# Altium schematic sheet TPS40200BuckDesign.SchDoc
size 431 x 279 mm; Date: Not shown in title block; ApprovedBy: Not shown in title block; CheckedBy: Not shown in title block; Author: Not shown in title block; CompanyName: Not shown in title block; Engineer: Not shown in title block; Organization: Not shown in title block; Address1: Not shown in title block; Address2: Not shown in title block; Address3: Not shown in title block; Address4: Not shown in title block; DocumentNumber: 2; Revision: Use project parameter SCH_Rev; SheetNumber: 1; SheetTotal: 1; PageSetup: Record=PageOptions|CenterHorizontal=True|CenterVertical=True|PrintScale=1.00|XCorrection=1.00|YCorrection=1.00|PrintKind=0|BorderSize=5000000|LeftOffset=0|BottomOffset=0|Orientation=2|PaperLength=1000|PaperWidth=1000|Scale=100|PaperSource=15|PrintQuality=600|MediaType=1|DitherType=10|PaperKind=Letter|PrintScaleMode=1; CurrentTime: Not shown in title block; CurrentDate: Not shown in title block; Time: Not shown in title block; DocumentFullPathAndName: Not shown in title block; DocumentName: Not shown in title block; ModifiedDate: 1/25/2022; ImagePath: Not shown in title block
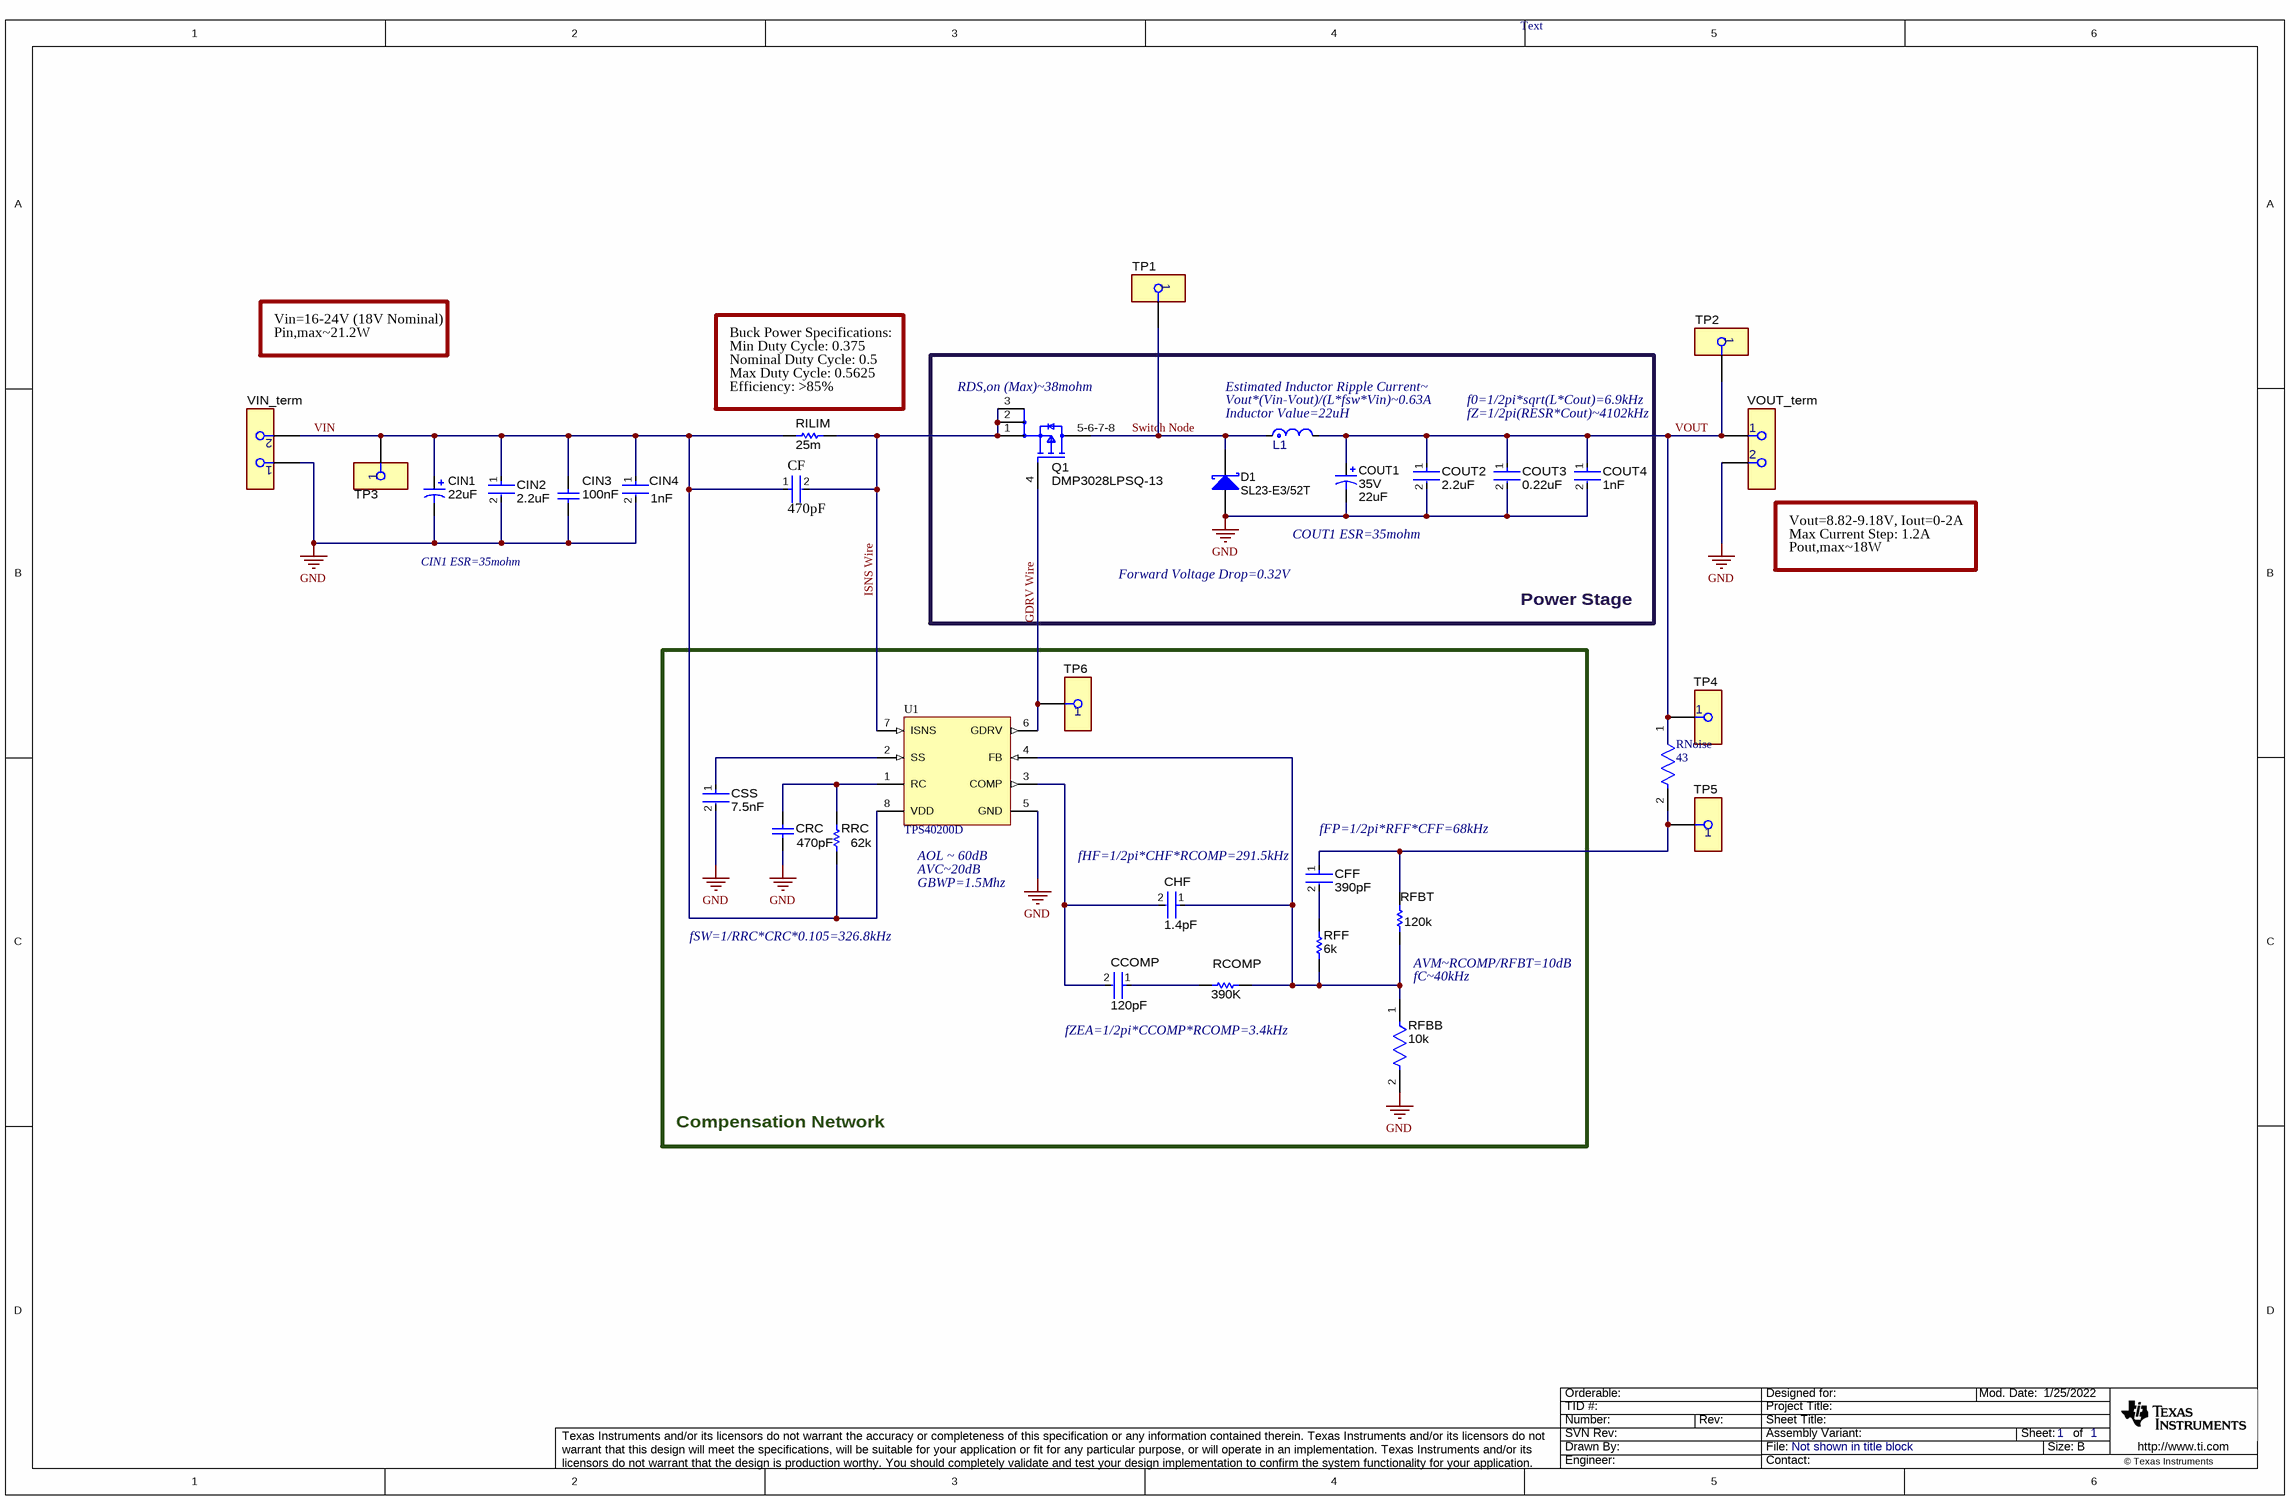
[diagram p0: TPS40200BuckDesign.SchDoc]

## Parts
CCOMP  120pF  [FP-CL21-IPC_C]
CF  470pF  [FP-0805-L_2_01_0_2-W_1_25-IPC_B]
CFF  390pF  [FP-CC0603-DA-MFG]
CHF  1.4pF  [FP-CBR06C-MFG]
CIN1  ValueDisplayed: 22uF  [CAPSMT_62_F61]  (hidden comment: 35SVPF22M)
CIN2  2.2uF  [FP-GRM188-0_1-e0_2_0_5-IPC_C]
CIN3  100nF  [CAPC1608X90X40LL10T20]
CIN4  1nF  [FP-C0603C-CF-MFG]
COUT1  VDC_V: 35V  ValueDisplayed: 22uF  [CAPSMT_62_F61]  (hidden comment: 35SVPF22M)
COUT2  2.2uF  [FP-CL10-IPC_C]
COUT3  0.22uF  [FP-GRM188-0_1-e0_2_0_5-IPC_C]
COUT4  1nF  [FP-CL10-IPC_C]
CRC  ValueDisplayed: 470pF  [0603]  (hidden comment: GCM1885C1H471JA16D)
CSS  7.5nF  [FP-GRM188-0_1-e0_2_0_5-IPC_C]
D1  SL23-E3/52T  [SMB]
L1  XAL8080-223MED  [FP-XAL8080-223MED_SMT_IND_8MM1_8MM6-MFG]  (value not drawn)
Q1  DMP3028LPSQ-13  [FP-DMP3028LPSQ-13_PowerDI5060-8-MFG]
RCOMP  390K  [RESC0805(2012)_M]
RFBB  10k  [FP-MCT0603-IPC_B]
RFBT  120k  [RESC1609X50X30ML10T20]
RFF  6k  [RESC1608X55X25ML10T15]
RILIM  25m  [RESC2013X50X40ML20T20]
RNoise  43  [FP-CR0603-IPC_C]
RRC  62k  [RESC1609X50X30NL10T20]
TP1  (no value)  [FP-RCWCTE_SMT_TP-MFG]
TP2  (no value)  [FP-RCWCTE_SMT_TP-MFG]
TP3  (no value)  [FP-RCWCTE_SMT_TP-MFG]
TP4  (no value)  [FP-RCWCTE_SMT_TP-MFG]
TP5  (no value)  [FP-RCWCTE_SMT_TP-MFG]
TP6  (no value)  [FP-RCWCTE_SMT_TP-MFG]
U1  TPS40200D  [D0008A_N]
VIN_term  (no value)  [FP-691137710002_HDR2-MFG]
VOUT_term  (no value)  [FP-691137710002_HDR2-MFG]

## Blocks framed on the sheet
Power Stage: COUT1-COUT4 D1 L1 Q1
Compensation Network: CCOMP CFF CHF CRC CSS RCOMP RFBB RFBT RFF RRC TP6 U1

## Nets
GND: CIN1.2(-) CIN2.2 CIN3.1 CIN4.2 COUT1.2(-) COUT2.2 COUT3.2 COUT4.2 CRC.2 CSS.2 D1.2(A) RFBB.2 U1.5(GND) VIN_term.1 VOUT_term.2
GDRV Wire: Q1.4(G) TP6.1 U1.6(GDRV)
ISNS Wire: CF.2 Q1.1(S) Q1.2(S) Q1.3(S) RILIM.2 U1.7(ISNS)
Switch Node: D1.1(K) L1.1 Q1.5-6-7-8(D) TP1.1
VIN: CF.1 CIN1.1(+) CIN2.1 CIN3.2 CIN4.1 RILIM.1 RRC.1 TP3.1 U1.8(VDD) VIN_term.2
VOUT: COUT1.1(+) COUT2.1 COUT3.1 COUT4.1 L1.2 RNoise.1 TP2.1 TP4.1 VOUT_term.1
NetCCOMP_1: CCOMP.1 RCOMP.1
NetCCOMP_2: CCOMP.2 CHF.2 U1.3(COMP)
NetCFF_1: CFF.1 RFBT.2 RNoise.2 TP5.1
NetCFF_2: CFF.2 RFF.2
NetCHF_1: CHF.1 RCOMP.2 RFBB.1 RFBT.1 RFF.1 U1.4(FB)
NetCRC_1: CRC.1 RRC.2 U1.1(RC)
NetCSS_1: CSS.1 U1.2(SS)

## Notes on the sheet
- Text
- Vin=16-24V (18V Nominal)
- Pin,max~21.2W
- Nominal Duty Cycle: 0.5
- Min Duty Cycle: 0.375
- Max Duty Cycle: 0.5625
- Buck Power Specifications:
- (near RILIM) Efficiency: >85%
- (near Q1) RDS,on (Max)~38mohm
- (near L1) Estimated Inductor Ripple Current~
- (near L1) Vout*(Vin-Vout)/(L*fsw*Vin)~0.63A
- (near L1) Inductor Value=22uH
- f0=1/2pi*sqrt(L*Cout)=6.9kHz
- fZ=1/2pi(RESR*Cout)~4102kHz
- CIN1 ESR=35mohm
- Forward Voltage Drop=0.32V
- COUT1 ESR=35mohm
- Vout=8.82-9.18V, Iout=0-2A
- Max Current Step: 1.2A
- Pout,max~18W
- (near CFF) fFP=1/2pi*RFF*CFF=68kHz
- AVC~20dB
- (near U1) AOL ~ 60dB
- GBWP=1.5Mhz
- fHF=1/2pi*CHF*RCOMP=291.5kHz
- fSW=1/RRC*CRC*0.105=326.8kHz
- (near RFBT) AVM~RCOMP/RFBT=10dB
- fC~40kHz
- fZEA=1/2pi*CCOMP*RCOMP=3.4kHz
- Drawn By:
- SVN Rev:
- Number:
- TID #:
- Orderable:
- Rev:
- Sheet Title:
- File:
- Project Title:
- Designed for:
- Assembly Variant:
- Mod. Date:
- Sheet:
- Size:
- of
- B
- http://www.ti.com
- Texas Instruments and/or its licensors do not warrant the accuracy or completeness of this specification or any information contained therein. Texas Instruments and/or its licensors do not warrant that this design will meet the specifications, will be suitable for your application or fit for any particular purpose, or will operate in an implementation. Texas Instruments and/or its licensors do not warrant that the design is production worthy. You should completely validate and test your design implementation to confirm the system functionality for your application.
- Engineer:
- Contact:
- © Texas Instruments

## Library data of the parts
CCOMP = CMP-13271-002834-1: CL21 Series 0805 120pF 200V ±5% Tolerance C0G Multilayer Ceramic Chip Capacitor; Case Code (Imperial): 0805; Depth: 1.25mm; Voltage Rating (DC): 200V; Capacitance: 120pF; Radiation Hardening: No; Packaging: Tape and Reel; Case/Package: 0805; Tolerance: 5%; Height: 0.85mm; Min Operating Temperature: -55°C; Thickness: 0.037inch; Max Operating Temperature: 125°C; Mount: Surface Mount; Package Quantity: 1; Dielectric: C0G; Case Code (Metric): 2012; Length: 2mm; Lead Free: Lead Free; Width: 0.049inch; Voltage Rating: 200V
CF = CMP-2007-04559-2: General Purpose Ceramic Capacitor, 0805, 470pF, 5%, C0G, 30ppm/°C, 100V; Dissipation Factor: 2.5%; Insulation Resistance: 100GR; Temperature Coefficient: 30ppm/°C; Lead Free: Lead Free; Capacitance: 470pF; RoHS Compliant: Yes; Voltage Rating: 100V; Tolerance: 5%; Dielectric: C0G; Depth: 1.25mm; Package Quantity: 1; Min Operating Temperature: -55°C; Height: 0.94mm; Radiation Hardening: No; REACH SVHC: No SVHC; Number of Pins: 2; Thickness: 0.037inch; Case Code (Metric): 2012; Packaging: Tape and Reel; Case/Package: 0805; Contact Plating: Tin; Width: 1.25mm; Construction: Flat; Mount: Surface Mount; Termination: SMD/SMT; Max Operating Temperature: 125°C; Case Code (Imperial): 0805; Series: -; Size: 0.94mm; Length: 2.01mm; Voltage: 100V; Voltage Rating (DC): 100V
CFF = CMP-03422-000674-1: CAP CER 390PF 50V X7R 0603; Manufacturer: YAGEO; Manufacturer Part Number: CC0603KRX7R9BB391; Tolerance: 0.1; Temperature Coefficient: 15%; Device Class L1: Passive Components; Height: 0.9mm; RoHS: TRUE; Octopart: https://octopart.com/cc0603krx7r9bb391-yageo-39467837; Device Class L3: Ceramic Capacitors; ComponentLink2Description: Datasheet; Category: Cap; Digikey Description: CAP CER 390PF 50V X7R 0603; Device Class L2: Capacitors; Voltage: 50 V; Temperature Range Low: -55°C; Temperature: -55°C to +125°C; Temperature Range High: +125°C; Temperature Characteristic: X7R; ComponentLink2URL: http://www.yageo.com/documents/recent/UPY-GPHC_X7R_6.3V-to-50V_18.pdf; Material: Ceramic; Package: CC0603-DA; Mouser Description: 0603 390 pF 50 V ±10 % Tolerance X7R SMT Multilayer Ceramic Capacitor; Lead Free: Yes; Footprint Url: http://www.yageo.com/exep/pages/download/literatures/UPY-C_GEN_24.pdf; Automotive: No; Value: 390 pF; Voltage Rating: 50 V; Capacitance: 390 pF
CHF = CMP-03020-006281-1: CBR0603 1.4 pF C0G 30ppm/°C 0.1 pF 50 V; Manufacturer Part Number: CBR06C149B5GAC; Manufacturer: KEMET; Voltage Rating: 50 V; Tolerance: 0.1 pF; Device Class L1: Passive Components; Lead Free: Yes; Capacitance: 1.4 pF; Device Class L2: Capacitors; RoHS: TRUE; Height: 0.87mm; Ipc Land Pattern Name: CAPC16080X80; ComponentLink2URL: https://content.kemet.com/datasheets/KEM_C1030_CBR_SMD.pdf; Automotive: No; Temperature Range High: +125°C; Category: Cap; Package: CBR06C; Temperature Coefficient: 30ppm/°C; Value: 1.4 pF; Material: Ceramic; Octopart: https://octopart.com/cbr06c149b5gac-kemet-84758707; Device Class L3: Ceramic Capacitors; Temperature Characteristic: C0G; Temperature Range Low: -55°C; Temperature: -55°C to +125°C; ComponentLink2Description: Datasheet
CIN1 = CMP-0012134-2: CAP, Aluminum Polymer, 22 uF, 35 V, +/- 20%, 0.035 ohm, F61 SMD; Manufacturer: Panasonic; TaMin_C: -55°C; ESR_ohm: 35m; Polarized: Y; SizeAreaWB_mm2: 73.96; U/M: EA; Value: 22uF; TaMax_C: 105°C; SizeZ_mm: 5.8; SizeX_mm: 6.6; Value2: 35V; SizeArea_mm2: 43.56; CompType: Capacitor; Cap_F: 22µF; IRMS_A: 2.6A; AEC Category: Q200; Publisher: Texas Instruments; RoHS: Y; Value1: 0.035 ohm; MountType: SMT; PackageReference: F61; Tolerance_%: 20%; SizeY_mm: 6.6; LatestRevisionDate: 2017-03-09; PartNumber: 35SVPF22M; AEC Qualified: ?; Series: SVPF; ComponentLink1Description: Datasheet link; Technology: Aluminum Polymer; ComponentLink1URL: http://industrial.panasonic.com/www-data/pdf/AAB8000/AAB8000CE1.pdf
CIN2 = CMP-2006-02548-2: Chip Multilayer Ceramic Capacitors for General Purpose, 0603, 2.2uF, X5R, 15%, 10%, 35V; REACH SVHC: No SVHC; Weight: 0.000222oz; Thickness: 0.035inch; Height: 0.8mm; Voltage Rating: 35V; Lead Free: Lead Free; Mount: Surface Mount; Material: Ceramic; Package Quantity: 4000; Capacitance: 2.2uF; Length: 1.6mm; Packaging: Tape and Reel; Case/Package: 0603; Min Operating Temperature: -55°C; Case Code (Metric): 1608; Voltage: 35V; Tolerance: 10%; Max Operating Temperature: 85°C; Depth: 0.8mm; Width: 0.8mm; Case Code (Imperial): 0603; Voltage Rating (DC): 35V; Termination: SMD/SMT; Dielectric: X5R
CIN3 = CMP-1035-02594-2: Chip Capacitor, 100 nF, - 20% to + 80%, 50 V, -30 to 85 degC, 0603 (1608 Metric), RoHS, Tape and Reel; Manufacturer: Yageo; Tolerance: -20%,+80%; Capacitance: 0.1µF; Product Training Modules: MultilayerCeramicCapacitors; Temperature Coefficient: Y5V(F); Kits: CC060300000000000-ND-MLCC0603SAMPLEKIT; Other Names: 311-1343-1; Featured Product: CommodityMultilayerCeramicCapacitors–CCSeries; Online Catalog: CCSeries; Voltage - Rated: 50V; Mounting Type: SurfaceMount,MLCC; Package Description: 2-Pin Surface Mount Device, Body 1.6 x 0.8 mm; Ratings: -; Lead Spacing: -; Standard Package: 1; Applications: GeneralPurpose; Size / Dimension: 0.063"Lx0.031"W(1.60mmx0.80mm); Package Reference: 0603; Operating Temperature: -30°C~85°C; Features: -; Height - Seated (Max): -; Thickness (Max): 0.035"(0.90mm); Series: CC; Datasheet URL: https://datasheet.ciiva.com/17434/upy-gphc-y5v-6-3v-to-50v-5-17434523.pdf; Family: CeramicCapacitors; Mounting Technology: SurfaceMount; Packaging: CutTape(CT); Package / Case: 0603(1608Metric); Manufacturer URL: http://www.yageo.com/; Category: Capacitors; Lead Style: -; Datasheet Version: Rev. 5, 07/2010
CIN4 = CMP-2006-03022-3: CAP CER 1000PF 50V X7R 0603; Manufacturer Part Number: C0603C102K5RACTU; Manufacturer: KEMET; Automotive Grade: Grade 1; Tolerance: 0.1; Value: 1,000 pF; Temperature Coefficient: 30ppm/°C; Temperature Characteristic: X7R; ComponentLink2URL: https://api.kemet.com/component-edge/download/datasheet/C0603C100J5GACAUTO.pdf; Temperature Range Low: -55°C; Capacitance: 1,000 pF; Device Class L2: Capacitors; Device Class L3: Ceramic Capacitors; Device Class L1: Passive Components; Temperature Range High: +125°C; Material: Ceramic; Digikey Description: CAP CER 1000PF 50V X7R 0603; Temperature: -55°C to +125°C; Voltage Rating: 50 V; Mouser Description: Capacitor; Ceramic; Cap; 1000pF; Tol 10%; SMT; Vol-Rtg 50V; X7R; Tape and Reel; Automotive: Yes; RoHS: TRUE; Octopart: https://octopart.com/c0603c102k5ractu-kemet-144878; Height: 0.87mm; Package: C0603C-CF; Lead Free: Yes; Category: Cap; ComponentLink2Description: Datasheet
COUT1 = CMP-0012134-2: CAP, Aluminum Polymer, 22 uF, 35 V, +/- 20%, 0.035 ohm, F61 SMD; Manufacturer: Panasonic; TaMin_C: -55°C; ESR_ohm: 35m; Polarized: Y; SizeAreaWB_mm2: 73.96; U/M: EA; Value: 22uF; TaMax_C: 105°C; SizeZ_mm: 5.8; SizeX_mm: 6.6; SizeArea_mm2: 43.56; CompType: Capacitor; Cap_F: 22µF; IRMS_A: 2.6A; AEC Category: Q200; Publisher: Texas Instruments; RoHS: Y; Value1: 0.035 ohm; MountType: SMT; PackageReference: F61; Tolerance_%: 20%; SizeY_mm: 6.6; Value2: 35V; LatestRevisionDate: 2017-03-09; PartNumber: 35SVPF22M; AEC Qualified: ?; Series: SVPF; ComponentLink1Description: Datasheet link; Technology: Aluminum Polymer; ComponentLink1URL: http://industrial.panasonic.com/www-data/pdf/AAB8000/AAB8000CE1.pdf
COUT2 = CMP-13271-000789-1: Cap Ceramic 2.2uF 10V Y5V -20/+80% Pad SMD 0603 +85°C T/R; Tolerance: 80%; Max Operating Temperature: 85°C; Height: 0.8mm; Case/Package: 0603; Voltage Rating: 10V; Capacitance: 2.2uF; Packaging: Tape and Reel; Radiation Hardening: No; Dielectric: Y5V; Mount: Surface Mount; Width: 0.031inch; Min Operating Temperature: -30°C; Thickness: 0.035inch; Depth: 0.8mm; Length: 1.6mm; Case Code (Metric): 1608; Case Code (Imperial): 0603
COUT3 = CMP-06035-003691-1: Chip Multilayer Ceramic Capacitors for General Purpose, 0603, 0.22uF, X7R, 15%, 10%, 50V; Capacitance: 220nF; Lead Free: Lead Free; Packaging: Tape and Reel; Max Operating Temperature: 125°C; Tolerance: 10%; Case Code (Imperial): 0603; Case/Package: 0603; Thickness: 0.035inch; Case Code (Metric): 1608; Voltage Rating (DC): 50V; Width: 0.031inch; Mount: Surface Mount; Voltage Rating: 50V; Length: 0.063inch; Min Operating Temperature: -55°C
COUT4 = CMP-13271-004292-1: Cap Ceramic 1nF 100V X7R ±10% Pad SMD 0603 +125°C T/R; Lead Free: Lead Free; Thickness: 0.035inch; Package Quantity: 10000; Voltage Rating (DC): 100V; Mount: Surface Mount; Dielectric: X7R; RoHS Compliant: Yes; Height: 0.8mm; Series: CL; Construction: Flat; Voltage Rating: 100V; Width: 0.031inch; Packaging: Tape and Reel; Max Operating Temperature: 125°C; Tolerance: 10%; Min Operating Temperature: -55°C; Capacitance: 1nF; Case/Package: 0603; Voltage: 100V; Length: 1.6mm; Radiation Hardening: No; Depth: 0.8mm
CRC = CMP-0007127-2: CAP, CERM, 470 pF, 50 V, +/- 5%, C0G/NP0, AEC-Q200 Grade 1, 0603; Manufacturer: MuRata; TaMin_C: -55°C; Polarized: N; SizeAreaWB_mm2: 4.68; Value1: Unknown; U/M: EA; Value: 470pF; TaMax_C: 125°C; SizeZ_mm: 1; SizeX_mm: 1.6; SizeY_mm: 0.8; Value2: 50V; SizeArea_mm2: 1.28; AEC Qualified: Y; AEC Category: Q200; Supplier Part Number 2: 81-GCM1885C1H471J16D; Publisher: Texas Instruments; Supplier 2: Mouser; TempCo: C0G/NP0; Published: 2008-06-19; RoHS: Y; MountType: SMT; Supplier 1: Digi-Key; PackageReference: 0603; Tolerance_%: 5%; Cap_Case: 0603; CompType: Capacitor; LatestRevisionDate: 2017-03-09; PartNumber: GCM1885C1H471JA16D; Cap_F: 470pF; ComponentLink1Description: Datasheet link; AEC Grade: 1; Supplier Part Number 1: 490-4965-1-ND; Technology: Ceramic; ComponentLink1URL: http://psearch.murata.com/capacitor/product/GCM1885C1H471JA16%23.pdf
CSS = CMP-06035-047924-1: Chip Multilayer Ceramic Capacitors for General Purpose, 0603, 7500pF, C0G, 30ppm/°C, 5%, 50V; Tolerance: 5%; Capacitance: 7.5nF; Thickness: 800um; Width: 800um; Dielectric: C0G; Voltage Rating (DC): 50V; Length: 1.6mm
D1 = CMP-0028578-2: Diode, Schottky, 30 V, 2 A, SMB; Manufacturer: Vishay-Semiconductor; SizeZ_mm: 2.6; TJmax_C: 125°C; Io_A: 2A; SizeArea_mm2: 21.336; SizeY_mm: 3.81; Vr_V: 30V; SizeX_mm: 5.6; Vf_V: 440mV; Green_REACh: Incomplete; Green_Lifecycle: Not Set; Value: 30V; RJC_CperW: 17; Value2: 0.44V; AEC Category: Q101; SizeAreaWB_mm2: 44.156; ComponentLink1URL: http://www.vishay.com/docs/88741/88741.pdf; Green_EU RoHS: Incomplete; PackageReference: SMB; Type: Schottky; Green_EU RoHS-2: Incomplete; Value1: 2A; CompType: Diode; PartNumber: SL23-E3/52T; MountType: SMT; RoHS: Y; ComponentLink1Description: Datasheet link; AEC Qualified: ?
L1 = CMP-0001669-1: 22 µH Shielded Molded Inductor 7.6A 32.9mOhm Max Nonstandard; Manufacturer: Coilcraft; AEC Grade: Grade 1; AEC Qualified: Yes; DCR_ohm: 32.9m; Ind_H: 22µH; Isat: 6.4A; Material: Composite; SizeZ_mm: 8mm; Value: 22uH; Self Resonant Frequency: 8.2MHz; Shrouded: true; TaMax_C: +125°C; TaMin_C: -40°C; Test Frequency: 1MHz; Tolerance_%: 20%; Irms: 7.6A; PackageReference: SMT_IND_8MM1_8MM6; PartNumber: XAL8080-223MED; RoHS: TRUE; Supplier 2: Mouser; Supplier Part Number 2: 994-XAL8080-223MED; Technology: Molded; Part Number: XAL8080-223MED; datasheet: https://www.coilcraft.com/getmedia/345e50d6-a804-4ecb-9a92-5185221faf3e/xal8080.pdf; Datasheet Path: datasheets/Ind-XAL8080-223MED.pdf; helpURL: https://upverter.com/upn/revision/e942f42e1132c320/; Lead Free: Yes; Mouser Description: Power inductor, shielded, 20% tol, SMT, RoHS, halogen-free; Mouser Part Number: 994-XAL8080-223MED; Operating Temperature Range: to; ComponentLink1Description: Datasheet; ComponentLink1URL: https://www.coilcraft.com/getmedia/345e50d6-a804-4ecb-9a92-5185221faf3e/xal8080.pdf
Q1 = CMP-0042040-1: P-Channel 30 V 21A (Tc) 1.28W Surface Mount PowerDI5060-8; Manufacturer: Diodes Inc.; AEC Qualified: Yes; IdsMax_A: -21A; QgTyp_nC: 22nC @ -10V; Rdson45_ohm: 18m; SizeZ_mm: 1.1mm; VdsMax_V: -1.2V; Vgs_V: 20V; ChMode: False; AEC Grade: Grade 0; Drain To Source Breakdown Voltage: -30V; Input Capacitace At Vds: 1372pF @ -15V; Number Of Channels: 1; Pulse Drain Current: -70A; Reverse Recovery Charge: 3.4nC; Reverse Recovery Time: 10.8ns; Rthja Max: 100°C/W; Standoff Height: 0mm; Threshold Vgs Max: -2.4V; Threshold Vgs Min: -1V; TJmax_C: +150°C; Turn Off Delay Time: 32.8ns; Turn On Delay Time: 4.8ns; Typ Forward Diode Voltage: -0.7V; PackageReference: PowerDI5060-8; PartNumber: DMP3028LPSQ-13; RoHS: TRUE; Part Number: DMP3028LPSQ-13; datasheet: https://www.diodes.com/assets/Datasheets/DMP3028LPSQ.pdf; Datasheet Path: datasheets/Trans-DMP3028LPSQ-13.pdf; Digikey Description: MOSFET P-CH 30V 21A PWRDI5060-8; Digikey Part Number: DMP3028LPSQ-13DICT-ND; helpURL: https://upverter.com/upn/revision/b40c729f0941e413/; Lead Free: Yes; Mouser Part Number: 621-DMP3028LPSQ-13; Number Of P Channels: 1; Operating Temperature Range: -55°C to +150°C; Power_W: 1.28W; ComponentLink1Description: Datasheet; ComponentLink1URL: https://www.diodes.com/assets/Datasheets/DMP3028LPSQ.pdf
RCOMP = CMP-1013-00136-1: 390K 0.125W 5% 0805 (2012 Metric)  SMD; Case-EIA: 0805; Case-Metric: 2012; Value: 390000.00 Ohm; Tolerance: 5 %; Power: 0.125 W; Technology: SMT
RFBB = CMP-02407-000530-1: RES SMD 100 OHM 1% 1/8W 0603; Resistance: 10kR; Voltage Rating (DC): 75V; Max Power Dissipation: 125mW; Tolerance: 0.1%; Temperature Coefficient: 25ppm/°C; Max Operating Temperature: 155°C; Case/Package: 0603; Contact Plating: Tin; Military Standard: Not; Number of Terminations: 2; Min Operating Temperature: -55°C; Radiation Hardening: No; Lead Free: Lead Free; Case Code (Imperial): 0603; Length: 1.55mm; Voltage Rating: 75V; Height: 0.45mm; Features: Automotive AEC-Q200; Case Code (Metric): 1608; REACH SVHC: No SVHC; Packaging: Tape and Reel; Depth: 0.85mm; Width: 0.033inch; Package Quantity: 1; Composition: Thin Film; Power Rating: 125mW
RFBT = CMP-2000-03869-1: Manufacturer: Vishay Dale; Part Number: CRCW0603120KJNEA
RFF = CMP-2000-04287-1: Part Number: RC0603JR-076K2L; Manufacturer: Yageo
RILIM = CMP-2001-03177-1: Manufacturer: Susumu; Part Number: RL1220T-R025-J
RNoise = CMP-07231-004962-1: Thick Film Chip Resistors 0603 43Ω 0.1W 1% 100ppm/°C; Voltage Rating: 50V; Max Power Dissipation: 100mW; Resistance: 43R; Thickness: 457um; Height: 0.022inch; Features: Moisture Resistant; Tolerance: 1%; Case Code (Imperial): 0603; Package Quantity: 5000; Contact Plating: Tin; Mount: Surface Mount; Composition: Thick Film; Length: 1.6mm; Number of Terminations: 2; Termination: SMD/SMT; Packaging: Tape and Reel; Radiation Hardening: No; Temperature Coefficient: 100ppm/°C; Depth: 0.8mm; Max Operating Temperature: 155°C; Military Standard: Not; Min Operating Temperature: -55°C; Case/Package: 0603; Width: 0.031inch; Power Rating: 100mW; Case Code (Metric): 1608
RRC = CMP-2000-03515-1: Manufacturer: Vishay Dale; Part Number: CRCW060362K0FKEA
TP1-TP6 = CMP-0031226-1: PC Test Point Plating Surface Mount Mounting Type; Manufacturer: KOA Speer; PartNumber: RCWCTE; ContactFinish: Tin,Copper; Current_A: 2A; AEC Qualified: No; Conn Gender: Female; Is Female: yes; SizeZ_mm: 2mm; PackageReference: SMT_TP; PinCount: 1; RoHS: TRUE; Supplier 1: Digikey; Supplier 2: Mouser; Supplier Part Number 1: 2019-RCWCTECT-ND; Supplier Part Number 2: 660-RCWCTE; Part Number: RCWCTE; datasheet: https://www.koaspeer.com/pdfs/RC.pdf; Datasheet Path: datasheets/Conn-RCWCTE.pdf; Digikey Description: PC TEST POINT; Digikey Part Number: 2019-RCWCTECT-ND; helpURL: https://upverter.com/upn/revision/0d6092c830e4cfc2/; Lead Free: Yes; Mouser Description: Current Sense Resistors - SMD CHIP CHECKER HT=2.0 1206; Mouser Part Number: 660-RCWCTE; Operating Temperature Range: -55°C to +125°C; ComponentLink1Description: Datasheet; ComponentLink1URL: https://www.koaspeer.com/pdfs/RC.pdf
U1 = CMP-0346-00066-2: Wide Input Non-Synchronous Buck DC / DC Controller, 90 % Duty Cycle, 4.5 to 52 V, -40 to 85 degC, 8-pin SOIC (D), Green (RoHS & no Sb/Br); Manufacturer: Texas Instruments; Switching Frequency(Max)(kHz): 500; Vout(Min)(V): 0.7; Vin(Max)(V): 52; SubFamily: Step-Down Controller; Vout(Max)(V): 46; Regulated Outputs(#): 1; Vin(Min)(V): 4.5; Duty Cycle(Max)(%): 90; Iout(Max)(A): 3; Eco-Plan: Green (RoHS & no Sb/Br); Topology: Buck; Mounting Technology: Surface Mount; ComponentLink2Description: Package Specification; ComponentLink1URL: http://www.ti.com/general/docs/lit/getliterature.tsp?genericPartNumber=TPS40200&fileType=pdf; Code_JEDEC: MS-012AA; PackageReference: D0008A; ComponentLink2URL: http://www.ti.com/litv/pdf/msoi002j; PackageDescription: 8-Pin Plastic Small Outline Integrated Circuit, 4.9 x 3.9 mm, Pitch 1.27 mm Pitch; DatasheetVersion: SLUS659F; PartNumber: TPS40200D; PackageVersion: revM, Jun-2011; ComponentLink1Description: Datasheet; Iout2(A): 3
VIN_term VOUT_term = CMP-0087503-1: TERM BLK 2POS SIDE ENTRY 5MM PCB; PartNumber: 691137710002; Manufacturer: Würth Elektronik; Symbol Name: SYM-691137710002; Row_Count: 1; Current_A: 16A; ContactFinish: Tin,Nickel; Voltage_V: 300V; ComponentLink1URL: https://katalog.we-online.com/em/datasheet/691137710002.pdf; PinCount: 2; RoHS: TRUE; PackageReference: HDR2; ComponentLink1Description: Datasheet